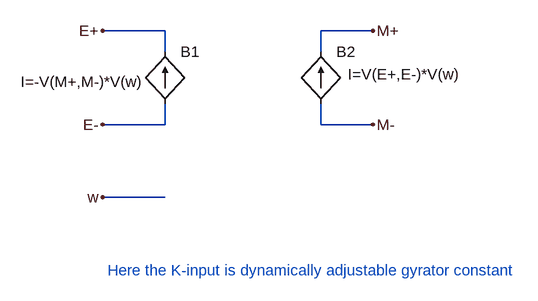
[diagram p0: schematic dynamic-gyrator.asc]
dynamic-gyrator.asc, the LTspice schematic file:
Version 4
SHEET 1 1268 680
WIRE -176 48 -272 48
WIRE 144 48 64 48
WIRE -176 80 -176 48
WIRE 64 80 64 48
WIRE -176 192 -176 160
WIRE -176 192 -272 192
WIRE 64 192 64 160
WIRE 144 192 64 192
WIRE -176 304 -272 304
FLAG -272 48 E+
FLAG -272 192 E-
FLAG 144 48 M+
FLAG 144 192 M-
FLAG -272 304 w
SYMBOL bi2 -176 80 R0
WINDOW 3 -222 46 Left 0
SYMATTR Value I=-V(M+,M-)*V(w)
SYMATTR InstName B1
SYMBOL bi2 64 80 R0
WINDOW 3 42 35 Left 0
SYMATTR Value I=V(E+,E-)*V(w)
SYMATTR InstName B2
TEXT -264 416 Left 0 ;Here the K-input is dynamically adjustable gyrator constant

The netlist it stands for:
* dynamic-gyrator.asc
B1 E- E+ I=-V(M+,M-)*V(w)
B2 M- M+ I=V(E+,E-)*V(w)
* Here the K-input is dynamically adjustable gyrator constant
.backanno
.end